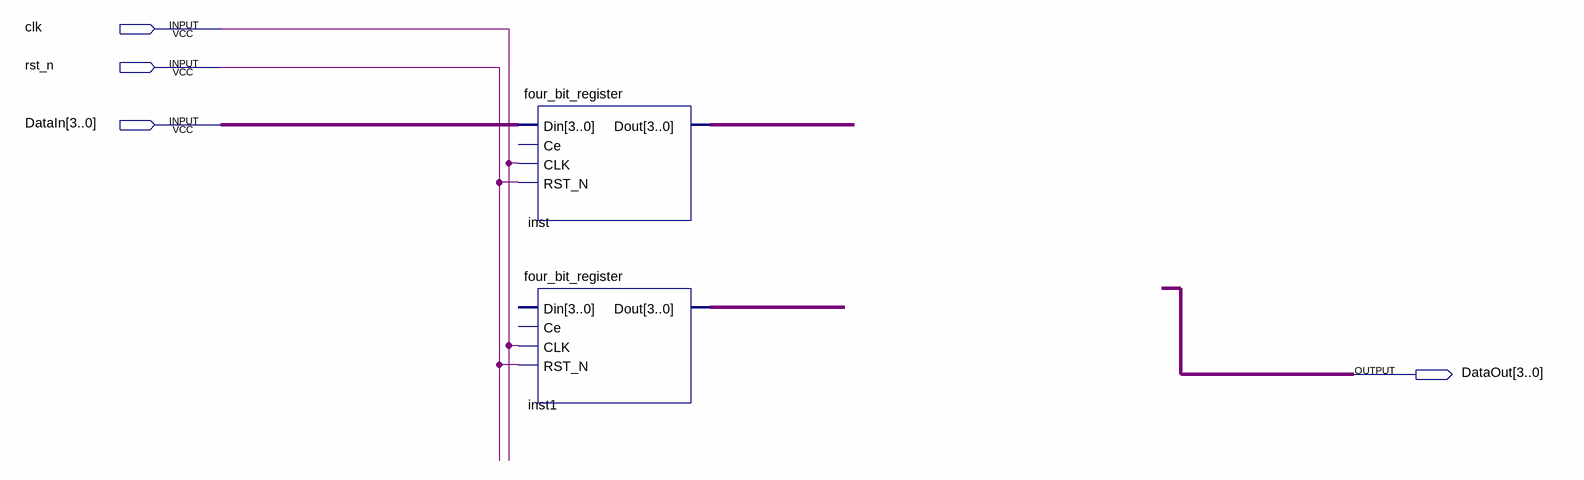
[diagram p0: schematic sheet]
// Quartus schematic fourbit_reg_sram.bdf as structural Verilog: 2 symbols, 4 pins
module fourbit_reg_sram (
  input  clk,
  input  rst_n,
  input  [3:0] DataIn,
  output [3:0] DataOut
);

  wire [3:0] inst1_dout, inst_dout;

  four_bit_register inst (.Din(DataIn), .CLK(clk), .RST_N(rst_n), .Dout(inst_dout));  // open: Ce
  four_bit_register inst1 (.CLK(clk), .RST_N(rst_n), .Dout(inst1_dout));  // open: Din, Ce
endmodule
